# EAGLE design led-board-rev-c (EAGLE 5.11)
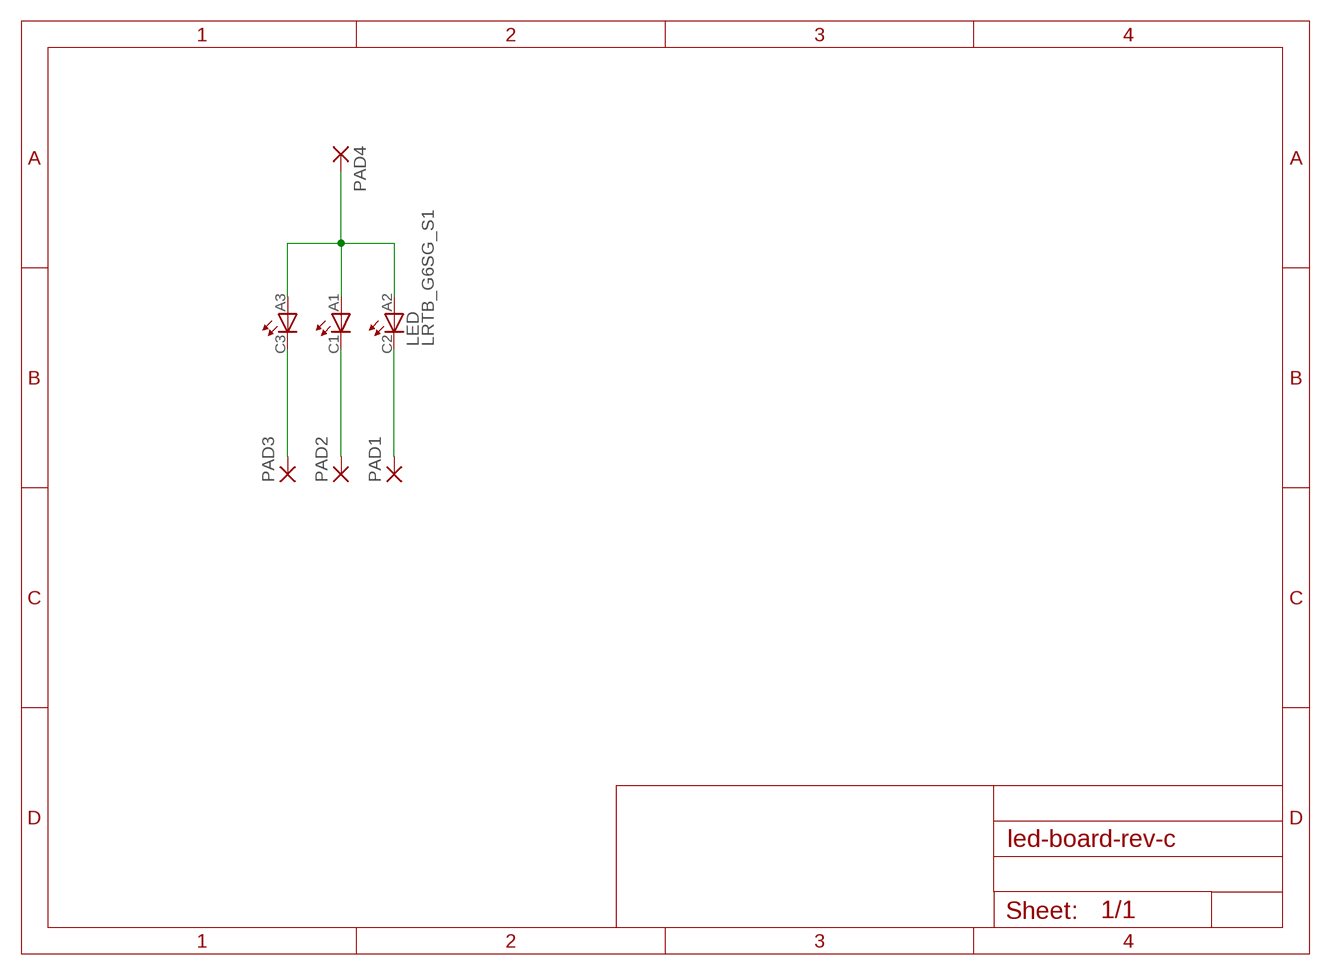
[diagram p0: schematic, sheet 1]

## Parts
LED  LRTB_G6SG_S1  [LRTB_G6SG_S1]
PAD1  SMD2  [SMD1,27-2,54]
PAD2  SMD2  [SMD1,27-2,54]
PAD3  SMD2  [SMD1,27-2,54]
PAD4  SMD2  [SMD1,27-2,54]

## Nets
A: LED.A1 LED.A2 LED.A3(A) PAD4.1(P)
C1: LED.C1 PAD2.1(P)
N$1: LED.C3(C) PAD3.1(P)
N$2: LED.C2 PAD1.1(P)

## Library data of the parts
LED = leds:LRTB_G6SG_S1
PAD1-PAD4 = wirepad:SMD2: SMD PAD

## Board
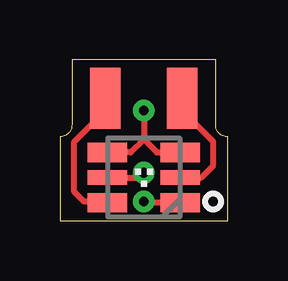
[diagram p1: board, top side]
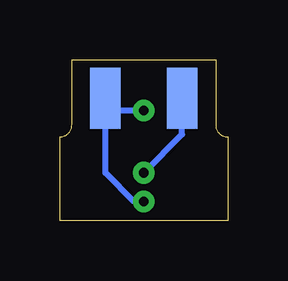
[diagram p2: board, bottom side, seen from below]

Size 7 x 6.7 mm. Coordinates in mm from the lower left corner, seen from the top.
Outline: 7,0 7,3.5 arc-90 6.5,4 6.5,6.7 0.5,6.7 0.5,4 arc-90 0,3.5 0,0 7,0
Copper layers (1*16): Top 0.035mm / dielectric 1.5mm / Bottom 0.035mm
Design rules "PCBCart-Standard *": minimum track width 8mil, minimum drill 0.4mm, track to track 8mil, track to pad 8mil, pad to pad 8mil, via to via 8mil, smd to smd 6mil, copper to edge 0.275mm, drill to drill 8mil, minimum pad ring 8mil, minimum via ring 10mil, stop-mask expansion 3mil, vias tented up to drill 0mil, thermal gap 8mil

### Footprints (pad centres in the part's own frame; a part is rotated, then mirrored left to right if it is on the bottom)
LRTB_G6SG_S1 = smd 0.8 x 1.65: A1 -1.05,-1.525; A2 1.05,-1.525; A3 1.05,1.525; C1 -1.05,1.525 | smd 0.6 x 1.65: C2 0,-1.525; C3 0,1.525
SMD1,27-2,54 = smd 1.27 x 2.54: 1 0,0

### Placement (x,y rotation side)
LED  3.5,1.8 90 top
PAD1  5.1,5.1 180 top
PAD2  1.9,5.1 180 top
PAD3  1.9,5.1 180 bottom
PAD4  5.1,5.1 180 bottom

### Tracks (layer width: path | path; a pad name or v marks a point on that pad's centre or on a via)
A  (via drill 0.4)
  Top 0.254: 5.03,3.08 LED.A2 4.05,2.85 3.5,3.4 | v3.5,4.6 3.5,3.4 | LED.A1 3.55,0.75 v3.5,0.8 | LED.A3 2.95,2.85 3.5,3.4
  Bottom 0.254: v3.5,0.8 3.9,0.8 5.1,2 PAD4.1 | PAD4.1 5,5 | v3.5,4.6 4.6,4.6 PAD4.1
C1
  Top 0.254: PAD2.1 1.9,4.6 0.6,3.3 0.6,1.2 1,0.8 1.93,0.8 LED.C1
N$1  (via drill 0.4)
  Top 0.254: LED.C3 3.3,1.8 v3.5,2
  Bottom 0.254: PAD3.1 1.9,3.6 v3.5,2
N$2
  Top 0.254: PAD1.1 5.3,4.9 5.3,4.4 6.4,3.3 6.4,2.3 5.9,1.8 LED.C2